# Altium schematic sheet GPIO_5V_LEVEL_SHIFTER.SchDoc
size A4
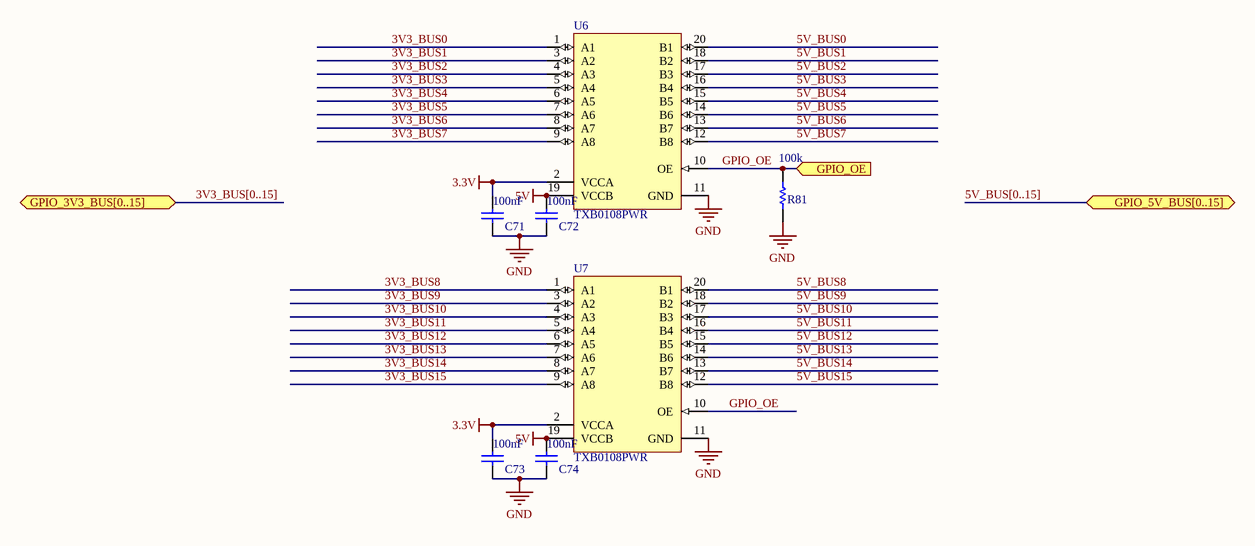
[diagram p0: GPIO_5V_LEVEL_SHIFTER.SchDoc]

## Parts
C71  value 100nF  [CAPC0402(1005)60_L]  (hidden comment: CAP0402)
C72  value 100nF  [CAPC0402(1005)60_L]  (hidden comment: CAP0402)
C73  value 100nF  [CAPC0402(1005)60_L]  (hidden comment: CAP0402)
C74  value 100nF  [CAPC0402(1005)60_L]  (hidden comment: CAP0402)
R81  value 100k  [RESC0402(1005)_L]  (hidden comment: RES0402)
U6  TXB0108PWR  [PW0020A_N]
U7  TXB0108PWR  [PW0020A_N]

## Ports
GPIO_3V3_BUS[0..15] (bidir), GPIO_5V_BUS[0..15] (bidir), GPIO_OE (in)

## Nets
3.3V: C71.1 C73.1 U6.2(VCCA) U7.2(VCCA)
5V: C72.1 C74.1 U6.19(VCCB) U7.19(VCCB)
GND: C71.2 C72.2 C73.2 C74.2 R81.1 U6.11(GND) U7.11(GND)
3V3_BUS0: U6.1(A1)
3V3_BUS1: U6.3(A2)
3V3_BUS2: U6.4(A3)
3V3_BUS3: U6.5(A4)
3V3_BUS4: U6.6(A5)
3V3_BUS5: U6.7(A6)
3V3_BUS6: U6.8(A7)
3V3_BUS7: U6.9(A8)
3V3_BUS8: U7.1(A1)
3V3_BUS9: U7.3(A2)
3V3_BUS10: U7.4(A3)
3V3_BUS11: U7.5(A4)
3V3_BUS12: U7.6(A5)
3V3_BUS13: U7.7(A6)
3V3_BUS14: U7.8(A7)
3V3_BUS15: U7.9(A8)
5V_BUS0: U6.20(B1)
5V_BUS1: U6.18(B2)
5V_BUS2: U6.17(B3)
5V_BUS3: U6.16(B4)
5V_BUS4: U6.15(B5)
5V_BUS5: U6.14(B6)
5V_BUS6: U6.13(B7)
5V_BUS7: U6.12(B8)
5V_BUS8: U7.20(B1)
5V_BUS9: U7.18(B2)
5V_BUS10: U7.17(B3)
5V_BUS11: U7.16(B4)
5V_BUS12: U7.15(B5)
5V_BUS13: U7.14(B6)
5V_BUS14: U7.13(B7)
5V_BUS15: U7.12(B8)
GPIO_OE: R81.2 U6.10(OE) U7.10(OE) ; port GPIO_OE

## Buses and harness runs
bus 3V3_BUS[0..15] = port GPIO_3V3_BUS[0..15]
bus 5V_BUS[0..15] = port GPIO_5V_BUS[0..15]

## Library data of the parts
C71-C74 = CMP-1590-00004-1: 0402 (1005 Metric) Chip Capacitor; Case-EIA: 0402; Case-Metric: 1005; PackageReference: CAPC0402(1005)60
R81 = CMP-1591-00004-1: 0402 (1005 Metric) Chip Resistor; Case-EIA: 0402; Case-Metric: 1005; PackageReference: RESC0402(1005)
U6 U7 = CMP-2000-07337-1: TXB0108 8-Bit Bidirectional Voltage-Level Translator with Auto-Direction Sensing and / +/- 15-kV ESD Protection, 1.2 to 3.6 V, -40 to 85 degC, 20-Pin TSSOP (PW), Green (RoHS & no Sb/Br), Tape and Reel; Manufacturer: Texas Instruments; Propagation Delay (Max): 4ns; Logic Function: Translator,Bidirectional; Input Type: Logic; Package Version: 4040064-5/G, 02/2011; Voltage - Supply: 1.2V~3.6V,1.65V~5.5V; Data Rate: 100Mbps; Other Names: 296-21527-6; Number of Channels: 8; Differential - Input: Output:No/No; Number of Outputs/Channel: 1; Product Training Modules: VoltageLevelTranslation; Dynamic Catalog: TXBSeries; Package Reference: PW20; Package Description: 20-Pin Small Outline Package Integrated Circuit, Body 6.5 x 4.4 mm, Pitch 0.65 mm; Category: IntegratedCircuits(ICs); Datasheet URL: http://www.ti.com/general/docs/lit/getliterature.tsp?genericPartNumber=TXB0108&fileType=pdf; Package / Case: 20-TSSOP(0.173",4.40mmWidth); Family: Logic-Translators; Standard Package: 1; Series: -; Manufacturer URL: http://www.ti.com/; Number of Bits: 8; Package URL: http://www.ti.com/litv/pdf/mpds362; Output Type: Logic; Datasheet Version: Rev. F, 12/2014; Packaging: Digi-Reel®; Operating Temperature: -40°C~85°C; Supplier Device Package: 20-TSSOP; Mounting Technology: SurfaceMount